# EasyEDA schematic Sheet_3.json
TITLE: 8 Bit ALU - 1 Bit; REV: 1.0; Date: 2021-12-28; Sheet: 3/3; Drawn By: Koehler, Paul; Company: komed3
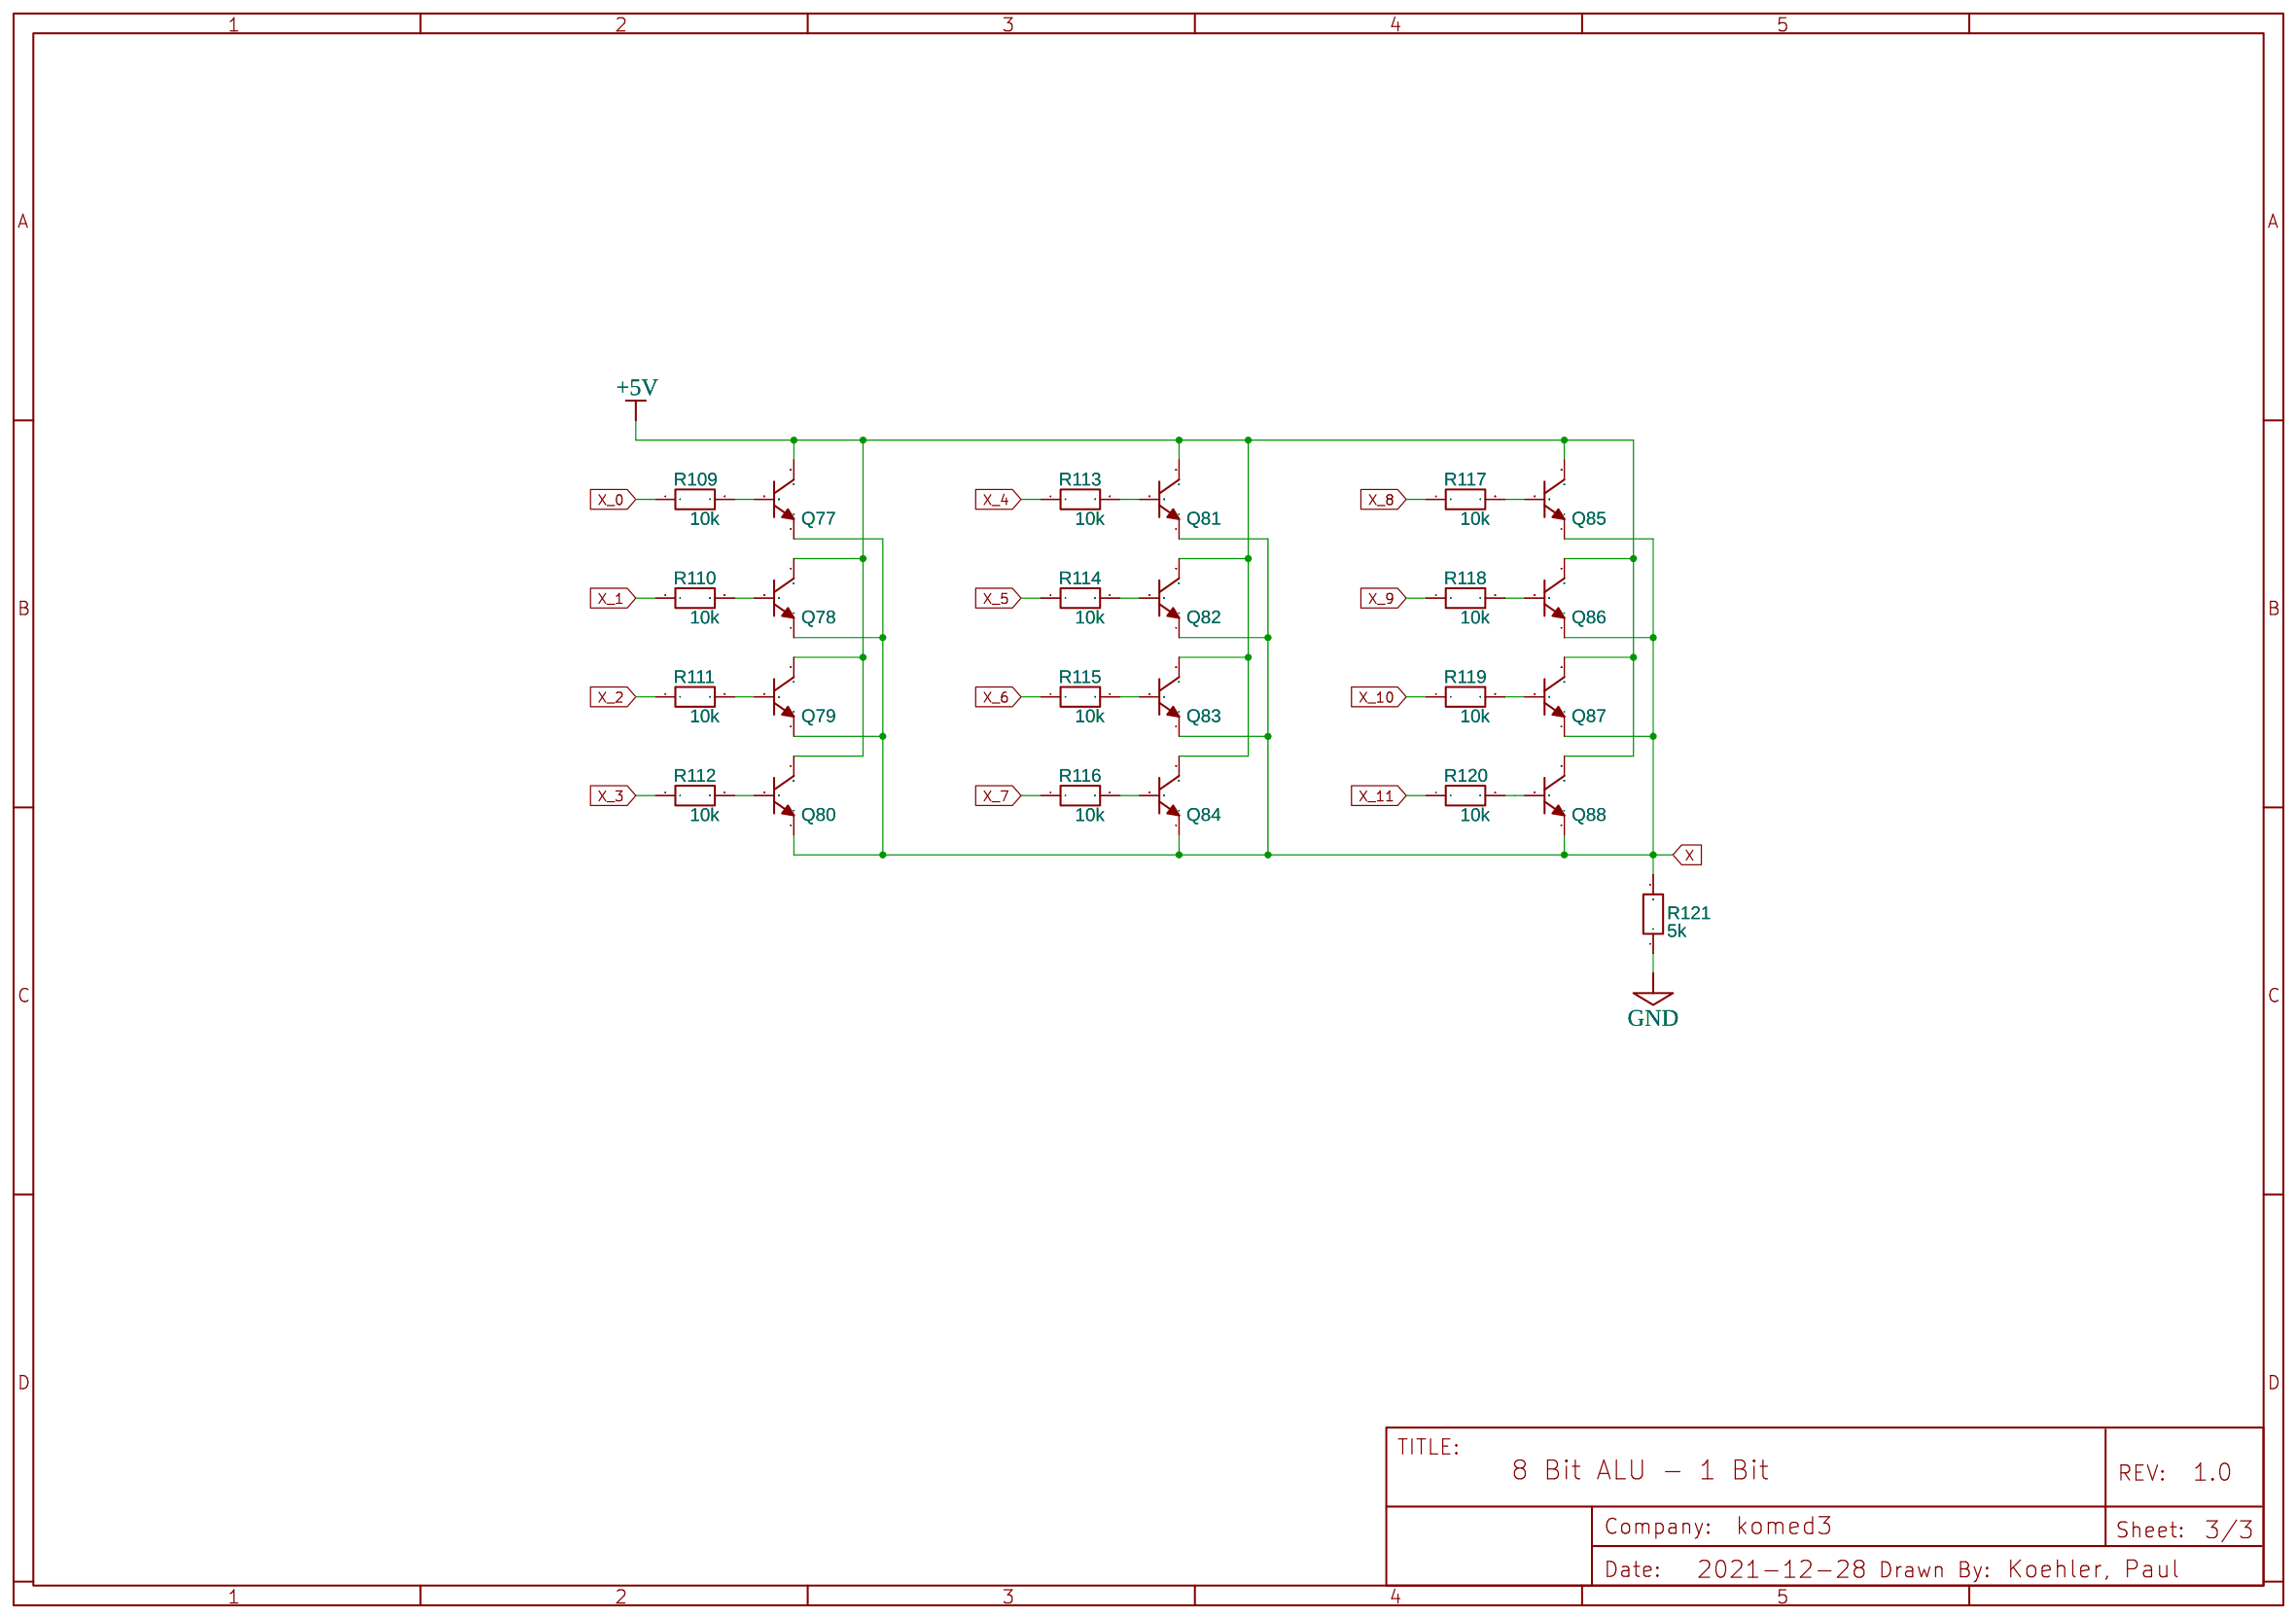
[diagram p0: schematic sheet]

## Parts
Q77  2N3904(TO-92)  [TO-92-3_L5.1-W4.1-P1.27-L]
Q78  2N3904(TO-92)  [TO-92-3_L5.1-W4.1-P1.27-L]
Q79  2N3904(TO-92)  [TO-92-3_L5.1-W4.1-P1.27-L]
Q80  2N3904(TO-92)  [TO-92-3_L5.1-W4.1-P1.27-L]
Q81  2N3904(TO-92)  [TO-92-3_L5.1-W4.1-P1.27-L]
Q82  2N3904(TO-92)  [TO-92-3_L5.1-W4.1-P1.27-L]
Q83  2N3904(TO-92)  [TO-92-3_L5.1-W4.1-P1.27-L]
Q84  2N3904(TO-92)  [TO-92-3_L5.1-W4.1-P1.27-L]
Q85  2N3904(TO-92)  [TO-92-3_L5.1-W4.1-P1.27-L]
Q86  2N3904(TO-92)  [TO-92-3_L5.1-W4.1-P1.27-L]
Q87  2N3904(TO-92)  [TO-92-3_L5.1-W4.1-P1.27-L]
Q88  2N3904(TO-92)  [TO-92-3_L5.1-W4.1-P1.27-L]
R109  10k  [RESISTOR-1/2W-VERTICAL]
R110  10k  [RESISTOR-1/2W-VERTICAL]
R111  10k  [RESISTOR-1/2W-VERTICAL]
R112  10k  [RESISTOR-1/2W-VERTICAL]
R113  10k  [RESISTOR-1/2W-VERTICAL]
R114  10k  [RESISTOR-1/2W-VERTICAL]
R115  10k  [RESISTOR-1/2W-VERTICAL]
R116  10k  [RESISTOR-1/2W-VERTICAL]
R117  10k  [RESISTOR-1/2W-VERTICAL]
R118  10k  [RESISTOR-1/2W-VERTICAL]
R119  10k  [RESISTOR-1/2W-VERTICAL]
R120  10k  [RESISTOR-1/2W-VERTICAL]
R121  5k  [RESISTOR-1/2W-VERTICAL]

## Library data of the parts
Q77-Q88 = 2N3904(TO-92): Supplier: LCSC; Manufacturer: SEMTECH; Manufacturer Part: 2N3904; Supplier Part: C118538; Contributor: LCEDA_Lib
R109-R121 = R_AXIAL-0.3_EU: Contributor: LCEDA_Lib

## Nets
+5V: Q77.3(C) Q78.3(C) Q79.3(C) Q80.3(C) Q81.3(C) Q82.3(C) Q83.3(C) Q84.3(C) Q85.3(C) Q86.3(C) Q87.3(C) Q88.3(C)
GND: R121.1
X: Q77.1(E) Q78.1(E) Q79.1(E) Q80.1(E) Q81.1(E) Q82.1(E) Q83.1(E) Q84.1(E) Q85.1(E) Q86.1(E) Q87.1(E) Q88.1(E) R121.2
X_0: R109.1
X_1: R110.1
X_2: R111.1
X_3: R112.1
X_4: R113.1
X_5: R114.1
X_6: R115.1
X_7: R116.1
X_8: R117.1
X_9: R118.1
X_10: R119.1
X_11: R120.1
Net-(Q77-2): Q77.2(B) R109.2
Net-(Q78-2): Q78.2(B) R110.2
Net-(Q79-2): Q79.2(B) R111.2
Net-(Q80-2): Q80.2(B) R112.2
Net-(Q81-2): Q81.2(B) R113.2
Net-(Q82-2): Q82.2(B) R114.2
Net-(Q83-2): Q83.2(B) R115.2
Net-(Q84-2): Q84.2(B) R116.2
Net-(Q85-2): Q85.2(B) R117.2
Net-(Q86-2): Q86.2(B) R118.2
Net-(Q87-2): Q87.2(B) R119.2
Net-(Q88-2): Q88.2(B) R120.2
